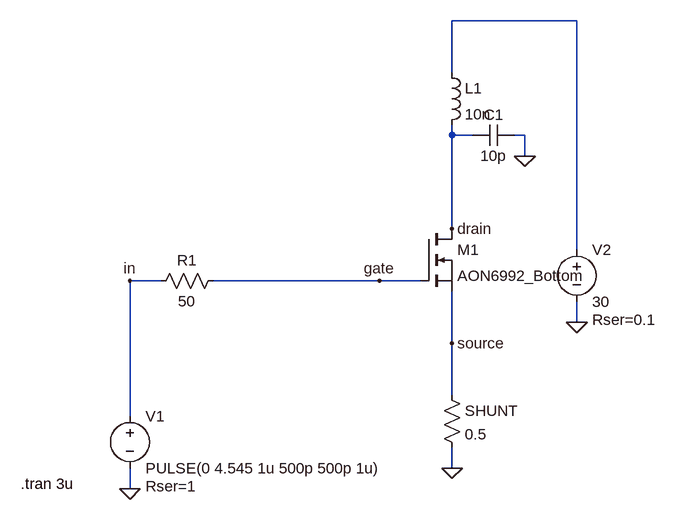
[diagram p0: schematic Simple Follower nonGaN.asc]
Simple Follower nonGaN.asc, the LTspice schematic file:
Version 4
SHEET 1 880 680
WIRE 480 -304 288 -304
WIRE 288 -224 288 -304
WIRE 288 -128 288 -144
WIRE 320 -128 288 -128
WIRE 400 -128 384 -128
WIRE 400 -96 400 -128
WIRE 288 16 288 -128
WIRE 480 48 480 -304
WIRE -160 96 -208 96
WIRE 176 96 -80 96
WIRE 240 96 176 96
WIRE 480 160 480 128
WIRE 288 192 288 112
WIRE 288 272 288 192
WIRE -208 304 -208 96
WIRE 288 384 288 352
WIRE -208 416 -208 384
FLAG 288 384 0
FLAG -208 416 0
FLAG 480 160 0
FLAG 176 96 gate
FLAG 288 192 source
FLAG 400 -96 0
FLAG 288 16 drain
FLAG -208 96 in
SYMBOL res 272 256 R0
SYMATTR InstName SHUNT
SYMATTR Value 0.5
SYMBOL voltage -208 288 R0
WINDOW 123 0 0 Left 0
WINDOW 39 24 124 Left 2
SYMATTR SpiceLine Rser=1
SYMATTR InstName V1
SYMATTR Value PULSE(0 4.545 1u 500p 500p 1u)
SYMBOL voltage 480 32 R0
WINDOW 123 0 0 Left 0
WINDOW 39 24 124 Left 2
SYMATTR SpiceLine Rser=0.1
SYMATTR InstName V2
SYMATTR Value 30
SYMBOL ind 272 -240 R0
SYMATTR InstName L1
SYMATTR Value 10n
SYMATTR SpiceLine Rser=0.1
SYMBOL res -64 80 R90
WINDOW 0 0 56 VBottom 2
WINDOW 3 32 56 VTop 2
SYMATTR InstName R1
SYMATTR Value 50
SYMBOL cap 384 -144 R90
WINDOW 0 0 32 VBottom 2
WINDOW 3 32 32 VTop 2
SYMATTR InstName C1
SYMATTR Value 10p
SYMBOL LTCSymbols\\NMOS 240 16 R0
SYMATTR InstName M1
SYMATTR Value AON6992_Bottom
TEXT -376 408 Left 2 !.tran 3u

The netlist it stands for:
* Simple Follower nonGaN.asc
R§SHUNT source 0 0.5
V1 in 0 PULSE(0 4.545 1u 500p 500p 1u) Rser=1
V2 N001 0 30 Rser=0.1
L1 N001 drain 10n Rser=0.1
R1 gate in 50
C1 0 drain 10p
M1 drain gate source source AON6992_Bottom
.model NMOS NMOS
.model PMOS PMOS
.lib standard.mos
.tran 3u
.backanno
.end